# EAGLE design ESCapemk2 (EAGLE 7.5.0)
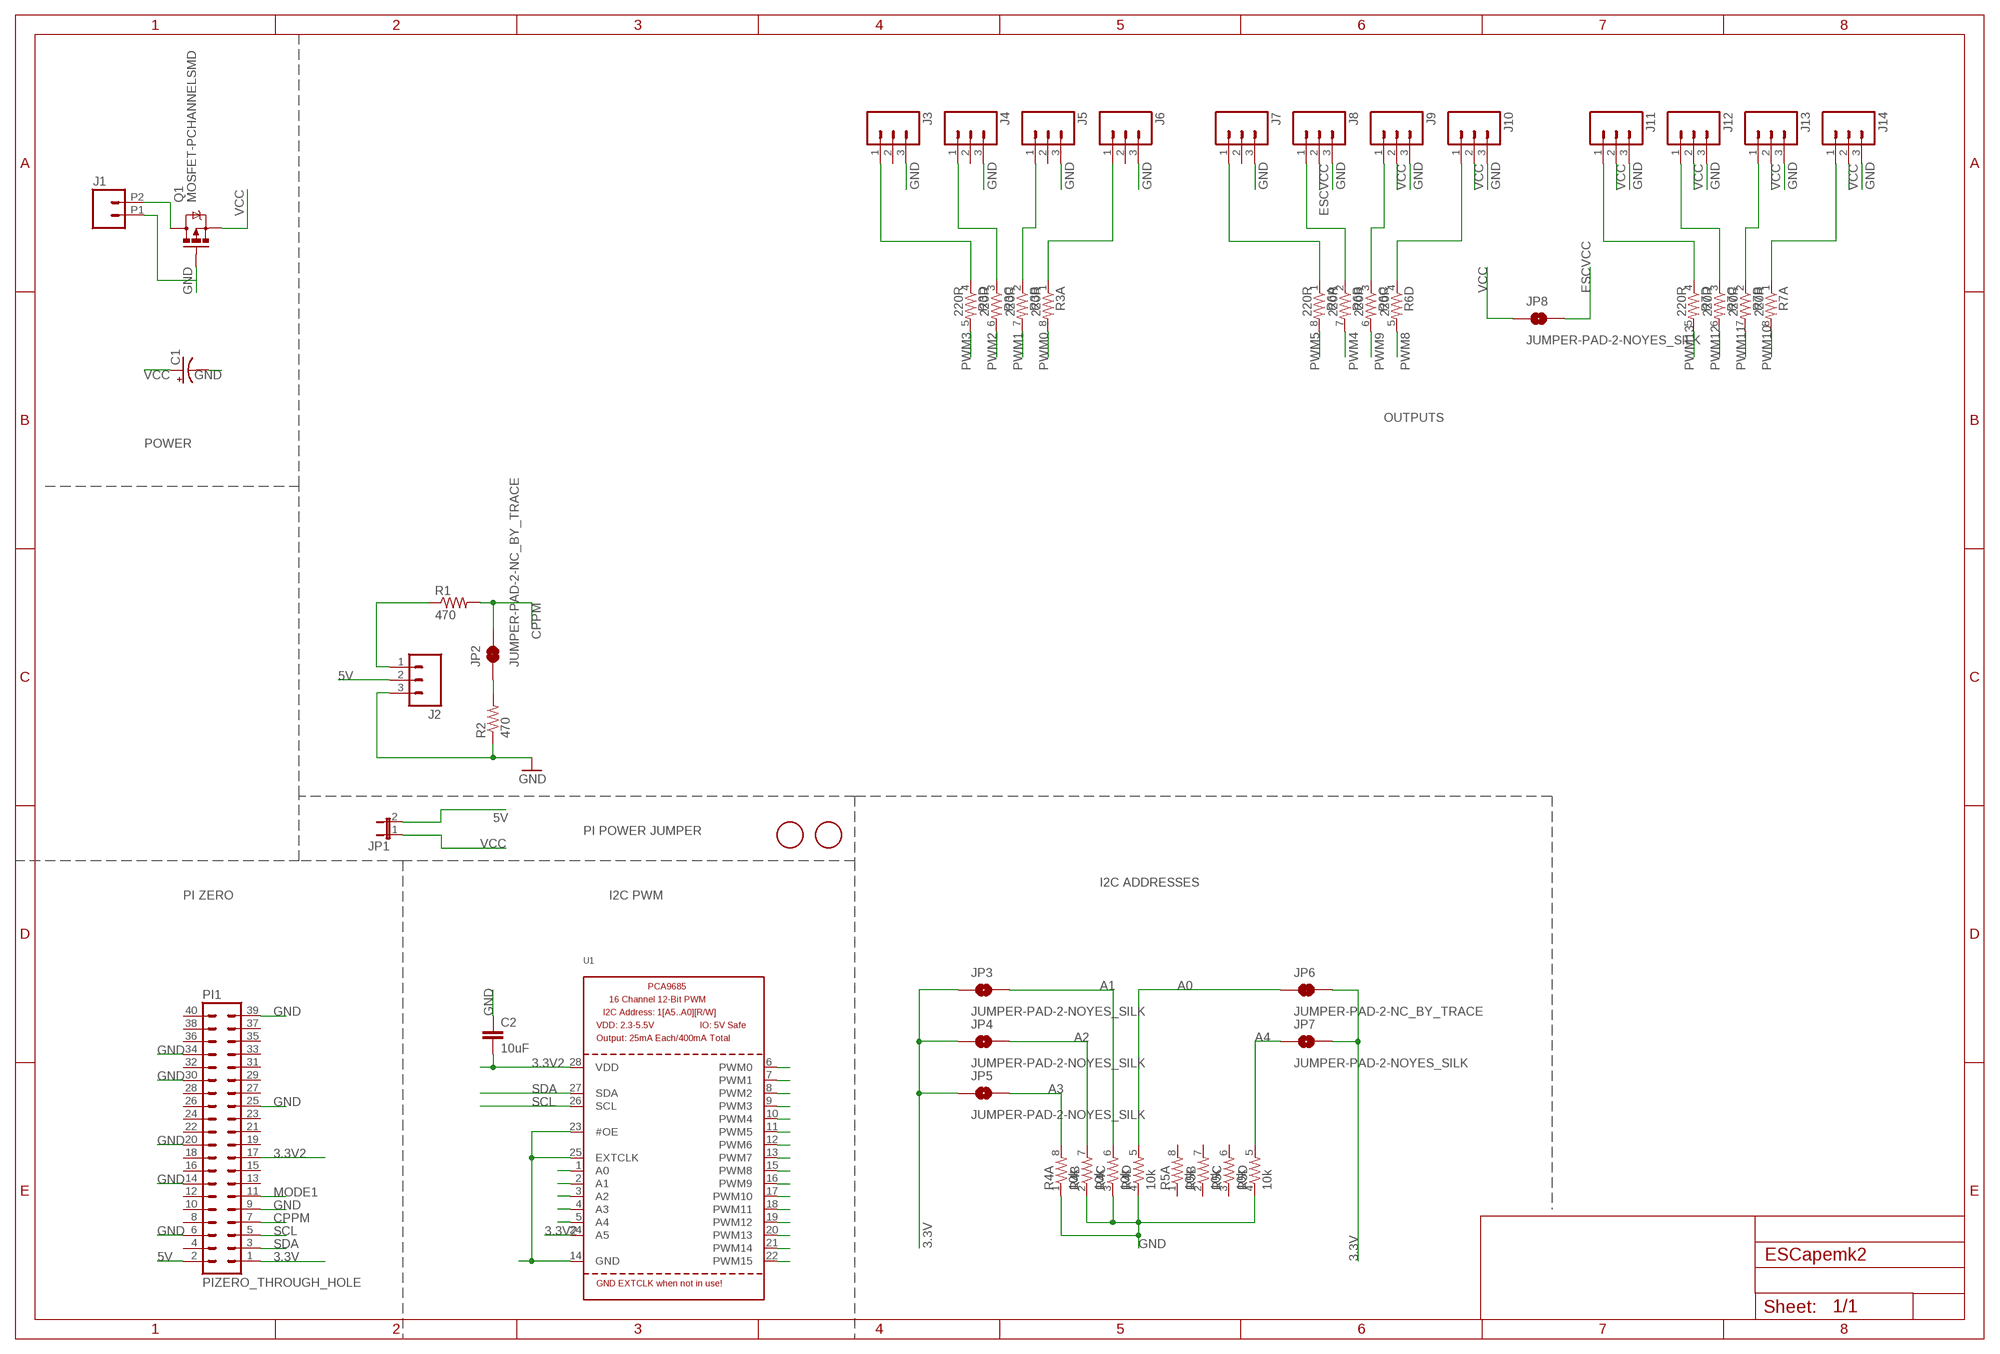
[diagram p0: schematic, sheet 1]
FRAME1 (A3L-LOC): CNAME: ESCape PCB; CREVISION: Mk2; DESIGNER: @shrkey

## Parts
C1  CAP_POLPTH1  [CPOL-RADIAL-100UF-25V]
C2  10uF  CAP0805  [0805]
FID1  FIDUCIAL  [FIDUCIAL_1MM]
FID2  FIDUCIAL  [FIDUCIAL_1MM]
J1  M022.54MM_SCREWTERM  [1X02_2.54_SCREWTERM]
J2  M03LOCK  [1X03_LOCK]
J3  M03LOCK  [1X03_LOCK]
J4  M03LOCK  [1X03_LOCK]
J5  M03LOCK  [1X03_LOCK]
J6  M03LOCK  [1X03_LOCK]
J7  M03LOCK  [1X03_LOCK]
J8  M03LOCK  [1X03_LOCK]
J9  M03LOCK  [1X03_LOCK]
J10  M03LOCK  [1X03_LOCK]
J11  M03LOCK  [1X03_LOCK]
J12  M03LOCK  [1X03_LOCK]
J13  M03LOCK  [1X03_LOCK]
J14  M03LOCK  [1X03_LOCK]
JP1  JUMPER-2PTH_LOCK  [1X02_LOCK]
JP2  JUMPER-PAD-2-NC_BY_TRACE  [PAD-JUMPER-2-NC_BY_TRACE_YES_SILK]
JP3  JUMPER-PAD-2-NOYES_SILK  [PAD-JUMPER-2-NO_YES_SILK]
JP4  JUMPER-PAD-2-NOYES_SILK  [PAD-JUMPER-2-NO_YES_SILK]
JP5  JUMPER-PAD-2-NOYES_SILK  [PAD-JUMPER-2-NO_YES_SILK]
JP6  JUMPER-PAD-2-NC_BY_TRACE  [PAD-JUMPER-2-NC_BY_TRACE_YES_SILK]
JP7  JUMPER-PAD-2-NOYES_SILK  [PAD-JUMPER-2-NO_YES_SILK]
JP8  JUMPER-PAD-2-NOYES_SILK  [PAD-JUMPER-2-NO_YES_SILK]
PI1  PIZERO_THROUGH_HOLE  [PIZERO_THOUGH_HOLE]
Q1  MOSFET-PCHANNELSMD  [SOT23-3]
R1  470  RESISTOR0805-RES  [0805]
R2  470  RESISTOR0805-RES  [0805]
R3  220R  RESISTOR-ARRAY0603-ARV  [0603-ARV]
R4  10k  RESISTOR-ARRAY0603-ARV  [0603-ARV]
R5  10k  RESISTOR-ARRAY0603-ARV  [0603-ARV]
R6  220R  RESISTOR-ARRAY0603-ARV  [0603-ARV]
R7  220R  RESISTOR-ARRAY0603-ARV  [0603-ARV]
U1  PCA9685  [TSSOP28]

## Nets
3.3V: JP3.1 JP4.1 JP5.1 JP6.2 JP7.2 PI1.1
3.3V2: C2.2 PI1.17 U1.24(A5) U1.28(VDD)
5V: J2.2 JP1.2 PI1.2
A0: JP6.1 R4.5 U1.1(A0)
A1: JP3.2 R4.6 U1.2(A1)
A2: JP4.2 R4.7 U1.3(A2)
A3: JP5.2 R4.8 U1.4(A3)
A4: JP7.1 R5.5 U1.5(A4)
CPPM: JP2.2 PI1.7 R1.2
ESCVCC: J8.2 JP8.2
GND: C1.2(-) C2.1 J1.P1 J2.3 J3.3 J4.3 J5.3 J6.3 J7.3 J8.3 J9.3 J10.3 J11.3 J12.3 J13.3 J14.3 PI1.6 PI1.9 PI1.14 PI1.20 PI1.25 PI1.30 PI1.34 PI1.39 Q1.1(G) R2.1 R4.1 R4.2 R4.3 R4.4 R5.4 U1.14(GND) U1.23(#OE) U1.25(EXTCLK)
MODE1: PI1.11
N$1: J3.1 R3.4
N$2: J4.1 R3.3
N$4: J6.1 R3.1
N$5: J5.1 R3.2
N$6: J7.1 R6.1
N$7: J8.1 R6.2
N$8: J10.1 R6.4
N$9: J9.1 R6.3
N$10: J11.1 R7.4
N$11: J12.1 R7.3
N$12: J14.1 R7.1
N$13: J13.1 R7.2
N$14: J2.1 R1.1
N$16: JP2.1 R2.2
N$22: J1.P2 Q1.3(D)
PWM0: R3.8 U1.6(PWM0)
PWM1: R3.7 U1.7(PWM1)
PWM2: R3.6 U1.8(PWM2)
PWM3: R3.5 U1.9(PWM3)
PWM4: R6.7 U1.10(PWM4)
PWM5: R6.8 U1.11(PWM5)
PWM6: U1.12(PWM6)
PWM7: U1.13(PWM7)
PWM8: R6.5 U1.15(PWM8)
PWM9: R6.6 U1.16(PWM9)
PWM10: R7.8 U1.17(PWM10)
PWM11: R7.7 U1.18(PWM11)
PWM12: R7.6 U1.19(PWM12)
PWM13: R7.5 U1.20(PWM13)
PWM14: U1.21(PWM14)
PWM15: U1.22(PWM15)
SCL: PI1.5 U1.26(SCL)
SDA: PI1.3 U1.27(SDA)
VCC: C1.1(+) J9.2 J10.2 J11.2 J12.2 J13.2 J14.2 JP1.1 JP8.1 Q1.2(S)
Unconnected: J3.2 J4.2 J5.2 J6.2 J7.2 PI1.4 PI1.8 PI1.10 PI1.12 PI1.13 PI1.15 PI1.16 PI1.18 PI1.19 PI1.21 PI1.22 PI1.23 PI1.24 PI1.26 PI1.27 PI1.28 PI1.29 PI1.31 PI1.32 PI1.33 PI1.35 PI1.36 PI1.37 PI1.38 PI1.40 R5.1 R5.2 R5.3 R5.6 R5.7 R5.8

## Notes on the sheet
- OUTPUTS
- POWER
- PI POWER JUMPER
- I2C ADDRESSES
- PI ZERO | I2C PWM

## Library data of the parts
C1 = SparkFun-Passives:CAP_POL: Capacitor Polarized These are standard SMD and PTH capacitors. Normally 10uF, 47uF, and 100uF in electrolytic and tantalum varieties. Always verify the external diameter of the through hole cap, it varies with capacity, voltage, and manufacturer. The EIA devices should be standard.
C2 = SparkFun-Passives:CAP: Capacitor Standard 0603 ceramic capacitor, and 0.1" leaded capacitor.
FID1 FID2 = adafruit:FIDUCIAL: For use by pick and place machines to calibrate the vision/machine, 1mm By microbuilder.eu
J1 = SparkFun-Connectors:M02: Standard 2-pin 0.1" header. Use with - straight break away headers ( PRT-00116) - right angle break away headers (PRT-00553) - swiss pins (PRT-00743) - machine pins (PRT-00117) - female headers (PRT-00115) Molex polarized connector foot print use with: PRT-08233 with associated crimp pins and housings. 2.54_SCREWTERM for use with PRT-10571. 3.5mm Screw Terminal footprints for PRT-08084 5mm Screw Terminal footprints for use with PRT-08432
J2-J14 = SparkFun-Connectors:M03: Header 3 Standard 3-pin 0.1" header. Use with straight break away headers (SKU : PRT-00116), right angle break away headers (PRT-00553), swiss pins (PRT-00743), machine pins (PRT-00117), and female headers (PRT-00115). Molex polarized connector foot print use with SKU : PRT-08232 with associated crimp pins and housings.
JP1 = SparkFun-Retired:JUMPER-2: Jumper Basic 0.1" spaced jumper. Use with breakaway headers.
JP2 JP6 = SparkFun-Passives:JUMPER-PAD-2-NC_BY_TRACE
JP3-JP5 JP7 JP8 = SparkFun-Passives:JUMPER-PAD-2-NO
PI1 = pizero:PIZERO_THROUGH_HOLE
Q1 = SparkFun-DiscreteSemi:MOSFET-PCHANNEL: Generic PMOSFET IRLML2244 - TRANS-11153 (SOT-23 -20V -4.3A) (1.Gate 2.Source 3.Drain) FQP27P06 - COM-10349 <http://www.sparkfun.com/products/10349> (TO-220 -60V -27A) (1.Gate 2.Source 3.Drain)
R1 R2 = SparkFun-Passives:RESISTOR: Resistor Basic schematic elements and footprints for 0603, 1206, and PTH resistors.
R3-R7 = SparkFun-Resistors:RESISTOR-ARRAY: Array Chip Resistor Source: RS Component / Phycomp
U1 = adafruit:PCA9685: PCA9685 - 16 Channel 12-Bit I2C PWM Controller 5.0V tolerant 16 channel, 12-bit I2C PWM controller with 25mA per output (max. 400mA total) Digikey: 568-5931-1-ND

## Board
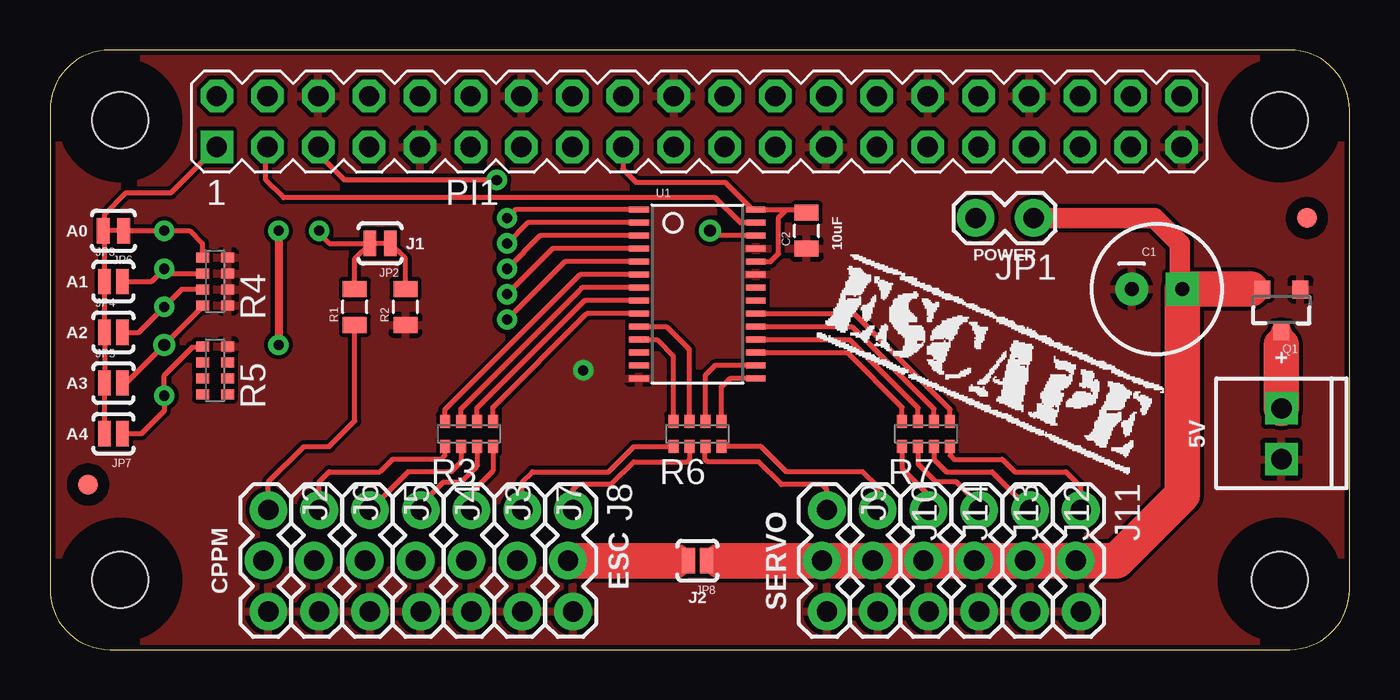
[diagram p1: board, top side]
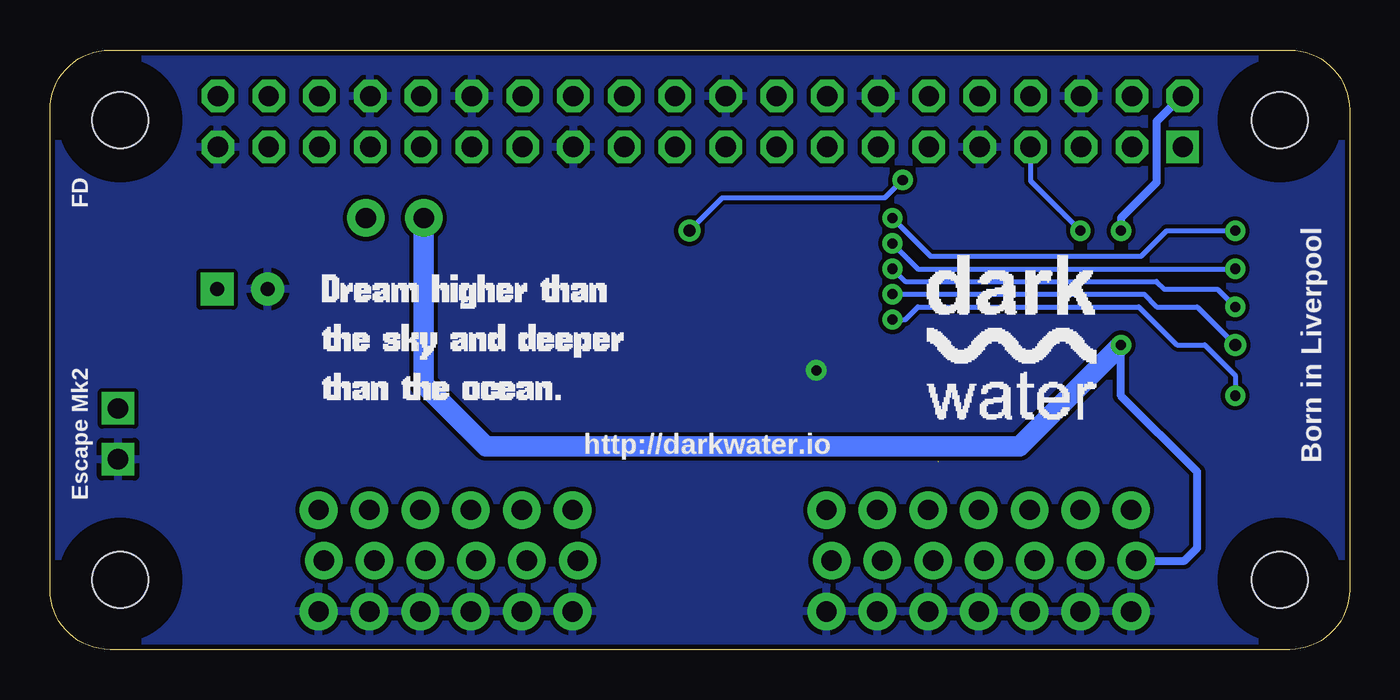
[diagram p2: board, bottom side, seen from below]

Size 65 x 30 mm. Coordinates in mm from the lower left corner, seen from the top.
Copper layers (1*16): Top 0.035mm / dielectric 1.5mm / Bottom 0.035mm
Design rules "SparkFun": minimum track width 8mil, minimum drill 20mil, track to track 8mil, track to pad 8mil, pad to pad 8mil, via to via 8mil, smd to smd 8mil, copper to edge 10mil, drill to drill 8mil, minimum pad ring 12mil, minimum via ring 10mil, stop-mask expansion 4mil, vias tented up to drill 25mil, thermal gap 10mil

### Footprints (pad centres in the part's own frame; a part is rotated, then mirrored left to right if it is on the bottom)
CPOL-RADIAL-100UF-25V = drill 0.7 pad 1.651 square: 1 1.27,0 | drill 0.7 pad 1.651: 2 -1.27,0
0805 = smd 0.8 x 1.2: 1 -0.9,0; 2 0.9,0
FIDUCIAL_1MM = smd 1 x 1: 1 0,0
1X02_2.54_SCREWTERM = drill 1.016 square: P1 2.54,0; P2 0,0
1X03_LOCK = drill 1.016 pad 1.88: 1 0,0.127; 2 2.54,-0.127; 3 5.08,0.127
1X02_LOCK = drill 1.016 pad 1.88: 1 -0.178,0; 2 2.718,0
PAD-JUMPER-2-NC_BY_TRACE_YES_SILK = smd 0.635 x 1.27: 1 -0.508,0; 2 0.508,0
PAD-JUMPER-2-NO_YES_SILK = smd 0.635 x 1.27: 1 -0.45,0; 2 0.45,0
PIZERO_THOUGH_HOLE = drill 1.016 square: 1 8.34,25.15 | drill 1.016 octagon: 2 8.34,27.69; 3 10.88,25.15; 4 10.88,27.69; 5 13.42,25.15; 6 13.42,27.69; 7 15.96,25.15; 8 15.96,27.69; 9 18.5,25.15; 10 18.5,27.69; 11 21.04,25.15; 12 21.04,27.69; 13 23.58,25.15; 14 23.58,27.69; 15 26.12,25.15; 16 26.12,27.69; 17 28.66,25.15; 18 28.66,27.69; 19 31.2,25.15; 20 31.2,27.69; 21 33.74,25.15; 22 33.74,27.69; 23 36.28,25.15; 24 36.28,27.69; 25 38.82,25.15; 26 38.82,27.69; 27 41.36,25.15; 28 41.36,27.69; 29 43.9,25.15; 30 43.9,27.69; 31 46.44,25.15; 32 46.44,27.69; 33 48.98,25.15; 34 48.98,27.69; 35 51.52,25.15; 36 51.52,27.69; 37 54.06,25.15; 38 54.06,27.69; 39 56.6,25.15; 40 56.6,27.69 | hole 2.8: 3.5,3.5; 3.5,26.5; 61.5,26.5; 61.5,3.5
SOT23-3 = smd 0.8 x 0.9: 1 -0.95,-1; 2 0.95,-1; 3 0,1.1
0603-ARV = smd 0.5 x 0.65: 1 -1.2,-0.625; 2 -0.4,-0.625; 3 0.4,-0.625; 4 1.2,-0.625; 5 1.2,0.625; 6 0.4,0.625; 7 -0.4,0.625; 8 -1.2,0.625
TSSOP28 = smd 0.305 x 0.991: 1 -4.225,-2.918; 2 -3.575,-2.918; 3 -2.925,-2.918; 4 -2.275,-2.918; 5 -1.625,-2.918; 6 -0.975,-2.918; 7 -0.325,-2.918; 8 0.325,-2.918; 9 0.975,-2.918; 10 1.625,-2.918; 11 2.275,-2.918; 12 2.925,-2.918; 13 3.575,-2.918; 14 4.225,-2.918; 15 4.225,2.918; 16 3.575,2.918; 17 2.925,2.918; 18 2.275,2.918; 19 1.625,2.918; 20 0.975,2.918; 21 0.325,2.918; 22 -0.325,2.918; 23 -0.975,2.918; 24 -1.625,2.918; 25 -2.275,2.918; 26 -2.925,2.918; 27 -3.575,2.918; 28 -4.225,2.918

### Placement (x,y rotation side)
C1  55.37,18.03 0 top
C2  37.85,20.95 90 top
FID1  62.87,21.59 0 top
FID2  1.91,8.26 0 top
J1  61.59,12.06 270 top
J2  10.79,6.99 270 top
J3  20.95,6.99 270 top
J4  18.41,6.99 270 top
J5  15.88,6.99 270 top
J6  13.34,6.99 270 top
J7  23.5,6.99 270 top
J8  26.04,6.99 270 top
J9  38.73,6.99 270 top
J10  41.27,6.99 270 top
J11  51.44,6.99 270 top
J12  48.9,6.99 270 top
J13  46.35,6.99 270 top
J14  43.81,6.99 270 top
JP1  49.02,21.59 180 top
JP2  16.51,20.32 180 top
JP3  3.17,18.41 0 top
JP4  3.17,15.88 0 top
JP5  3.17,13.34 0 top
JP6  3.17,20.95 180 top
JP7  3.17,10.79 180 top
JP8  32.38,4.45 180 top
PI1  0,0 0 top
Q1  61.59,17.02 180 top
R1  15.24,17.14 90 top
R2  17.78,17.14 90 top
R3  20.95,10.79 0 top
R4  8.26,18.41 90 top
R5  8.26,13.97 90 top
R6  32.38,10.79 0 top
R7  43.81,10.79 0 top
U1  32.38,17.78 270 top
U$4  [DREAM]  52.7,10.41 0 bottom
U$5  [DARKWATER]  21.08,11.56 0 bottom
U$6  [ESCAPENEW]  37.72,7.11 0 top

### Tracks (layer width: path | path; a pad name or v marks a point on that pad's centre or on a via)
3.3V
  Top 0.254: PI1.1 6.05,22.86 3.81,22.86 2.73,21.77 2.73,20.95 JP6.2 2.73,20.9 JP3.1 JP4.1 JP5.1 JP7.2
3.3V2
  Top 0.254: 36.83,22 U1.28 35.15,22 33.78,23.37 29.34,23.37 28.66,24.05 PI1.17 | 36.83,22 37.7,22 C2.2 | U1.24 36.04,19.41 36.45,19.81 36.45,21.62 36.83,22
5V  (via drill 0.51)
  Top 0.406: v11.43,20.95 v11.43,15.24
  Bottom 0.406: PI1.2 8.38,27.69 9.65,26.42 9.65,23.37 11.43,21.59 v11.43,20.95 | J2.2 8.26,4.45 7.62,5.08 7.62,8.89 11.43,12.7 v11.43,15.24
  Bottom 1.016: JP1.2 46.3,13.28 43.18,10.16 16.51,10.16 v11.43,15.24
A0  (via drill 0.51)
  Top 0.254: JP6.1 v5.71,20.95 6.99,20.95 7.62,20.32 7.62,19.62 R4.5 | U1.1 23.27,22 v22.86,21.59
  Bottom 0.254: v22.86,21.59 20.95,19.68 10.41,19.68 9.14,20.95 v5.71,20.95
A1  (via drill 0.51)
  Top 0.254: R4.6 7.61,18.8 5.97,18.8 v5.71,19.05 5.08,18.41 JP3.2 | U1.2 23.89,21.36 v22.86,20.32
  Bottom 0.254: v22.86,20.32 21.59,19.05 v5.71,19.05
A2  (via drill 0.51)
  Top 0.254: R4.7 6.58,18.02 v5.71,17.14 4.45,15.88 JP4.2 | U1.3 24.52,20.7 v22.86,19.05
  Bottom 0.254: 6.35,17.78 v5.71,17.14 6.6,18.03 9.27,18.03 9.65,18.41 22.23,18.41 v22.86,19.05
A3  (via drill 0.51, 0.6)
  Top 0.254: R4.8 7.63,17.16 v5.71,15.24 3.81,13.34 JP5.2 | U1.4 25.14,20.05 v22.86,17.78
  Bottom 0.254: 6.99,16.51 v5.71,15.24 7.62,17.14 9.65,17.14 10.29,17.78 v22.86,17.78
A4  (via drill 0.51)
  Top 0.254: 3.62,11.24 JP7.1 4.57,10.79 5.71,11.94 v5.71,12.7 5.71,13.72 7.11,15.11 7.57,15.11 R5.5 | U1.5 25.75,19.41 v22.86,16.51
  Bottom 0.254: v22.86,16.51 22.23,16.51 21.59,17.14 10.54,17.14 8.64,15.24 7.24,15.24 5.71,13.72 v5.71,12.7
CPPM  (via drill 0.51)
  Top 0.254: R1.2 15.24,19.56 JP2.2 13.97,20.32 13.46,20.83 v13.46,20.95
  Bottom 0.254: PI1.7 15.96,23.45 v13.46,20.95
ESCVCC
  Top 0.61: JP8.2 31.24,4.45
  Top 1.778: J8.2 31.24,4.45
GND  (via drill 0.51)
  other vias: 26.67,13.97
  pour Bottom: 0,27.3 0,2.54 arc90 2.54,0 62.23,0 arc90 64.77,2.54 64.77,27.3 arc90 62.23,29.84 2.54,29.84 arc90
  pour Top: 0,27.3 0,2.54 arc90 2.54,0 62.23,0 arc90 64.77,2.54 64.77,27.3 arc90 62.23,29.84 2.54,29.84 arc90
N$1
  Top 0.254: R3.4 22.16,8.95 21.08,7.87 J3.1
N$2
  Top 0.254: J4.1 18.54,7.24 19.68,8.38 20.57,8.38 21.36,9.16 R3.3
N$4
  Top 0.254: J6.1 13.46,8.38 13.97,8.89 16.51,8.89 17.14,9.53 19.56,9.53 19.75,9.71 R3.1
N$5  (1 unrouted)
  Top 0.254: R3.2 20.55,9.42 | 20.57,9.4 20.07,8.89 17.91,8.89 J5.1
N$6
  Top 0.254: J7.1 23.62,8.38 24.13,8.89 27.94,8.89 29.21,10.16 R6.1
N$7
  Top 0.254: J8.1 26.16,8 26.42,8.26 28.07,8.26 29.21,9.4 31.88,9.4 32,9.53 32,10.15 R6.2
N$8
  Top 0.254: J10.1 41.4,8.13 40.64,8.89 36.83,8.89 35.56,10.16 R6.4
N$9
  Top 0.254: J9.1 38.86,8 38.61,8.26 36.58,8.26 35.43,9.4 32.89,9.4 32.77,9.53 32.77,10.15 R6.3
N$10
  Top 0.254: J11.1 51.56,8.13 50.8,8.89 48.26,8.89 47.62,9.53 45.21,9.53 45.02,9.71 R7.4
N$11
  Top 0.254: R7.3 44.22,9.51 44.83,8.89 47.12,8.89 J12.1
N$12
  Top 0.254: J14.1 43.94,7.75 42.62,9.07 R7.1
N$13
  Top 0.254: J13.1 46.48,7.24 45.34,8.38 44.32,8.38 43.43,9.27 43.43,10.15 R7.2
N$14
  Top 0.254: J2.1 10.92,8.38 12.7,10.16 13.97,10.16 15.24,11.43 R1.1
N$16
  Top 0.254: R2.2 17.78,19.56 JP2.1
N$22
  Top 1.016: Q1.3 61.59,15.24
  Top 1.778: J1.P2 61.59,15.24
PWM0
  Top 0.254: R3.8 19.75,12.01 26.5,18.75 U1.6
PWM1
  Top 0.254: R3.7 20.55,12.05 26.48,17.97 26.54,18.03 26.61,18.11 U1.7
PWM2
  Top 0.254: R3.6 21.36,12.08 26.73,17.45 U1.8
PWM3
  Top 0.254: R3.5 22.16,12.12 26.84,16.8 U1.9
PWM4
  Top 0.254: R6.7 31.98,15.01 30.84,16.16 U1.10
PWM5
  Top 0.254: R6.8 31.18,14.68 30.36,15.51 U1.11
PWM8
  Top 0.254: U1.15 34,13.55 33.59,13.14 R6.5
PWM9
  Top 0.254: R6.6 32.78,13.73 33.26,14.21 U1.16
PWM10
  Top 0.254: R7.8 42.62,12.12 39.88,14.86 U1.17
PWM11
  Top 0.254: R7.7 43.41,12.08 39.99,15.51 U1.18
PWM12
  Top 0.254: R7.6 44.22,12.05 40.11,16.16 U1.19
PWM13
  Top 0.254: R7.5 45.02,12.01 40.22,16.8 U1.20
SCL  (via drill 0.51, 0.6)
  Top 0.254: U1.26 33.27,20.7 v33.02,20.95 | v22.35,23.5 14.73,23.5 13.42,24.81 PI1.5
  Bottom 0.254: v33.02,20.95 31.37,22.61 23.24,22.61 v22.35,23.5
SDA
  Top 0.254: PI1.3 10.79,25.07 10.79,23.5 11.68,22.61 33.27,22.61 34.52,21.36 U1.27
VCC
  Top 0.254: Q1.2 60.09,18.02 60.07,18.03
  Top 0.61: JP8.1 33.53,4.45
  Top 1.016: C1.1 56.52,18.16 56.52,20.32 55.24,21.59 JP1.1
  Top 1.778: 33.53,4.45 J9.2 J10.2 J14.2 J13.2 J12.2 J11.2 53.34,4.45 56.64,7.75 C1.1 60.07,18.03

### Text on the board
tPlace: A0 | 10uF | J1 | POWER | A1 | A2 | + | A3 | A4 | 5V | CPPM | ESC | SERVO | J2
bPlace: FD | Born in Liverpool | Escape Mk2 | http://darkwater.io